# Altium schematic sheet A1356.SchDoc: Hall Sensor
size A4; Author: Marcel Hellwig; Organization: Hamburg Bit-Bots; Address1: Vogt-Kölln-Str. 30; Address2: 22527 Hamburg; Address3: Germany; Address4: www.bit-bots.de; DocumentNumber: 3; SheetNumber: 3; SheetTotal: 4; EMail: info@bit-bots.de
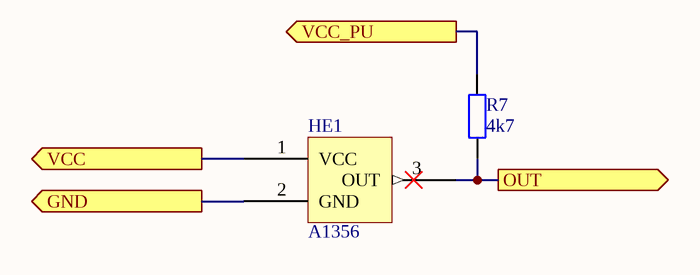
[diagram p0: A1356.SchDoc]

## Parts
HE1  A1356  [3-Pin SIP]
R7  4k7  [R2012]

## Ports
GND, OUT (out), VCC, VCC_PU

## Nets
GND: HE1.2(GND) ; port GND
OUT: HE1.3(OUT) R7.1 ; port OUT
VCC: HE1.1(VCC) ; port VCC
VCC_PU: R7.2 ; port VCC_PU

## Notes on the sheet
- Project:
- Author:
- Title:
- Rev:
- Date:
- Time:
- Sheet
- of

## Library data of the parts
HE1 = A1356: Linear Hall-Effect Sensor
R7 = Res2: Resistor; Published: 8-Jun-2000; LatestRevisionDate: 17-Jul-2002; LatestRevisionNote: Re-released for DXP Platform.; PackageReference: AXIAL-0.4; Publisher: Altium Limited; PackageDescription: Axial Device, Thru-Hole; 2 Leads; 0.4 in Pin Spacing; Value: 4k7